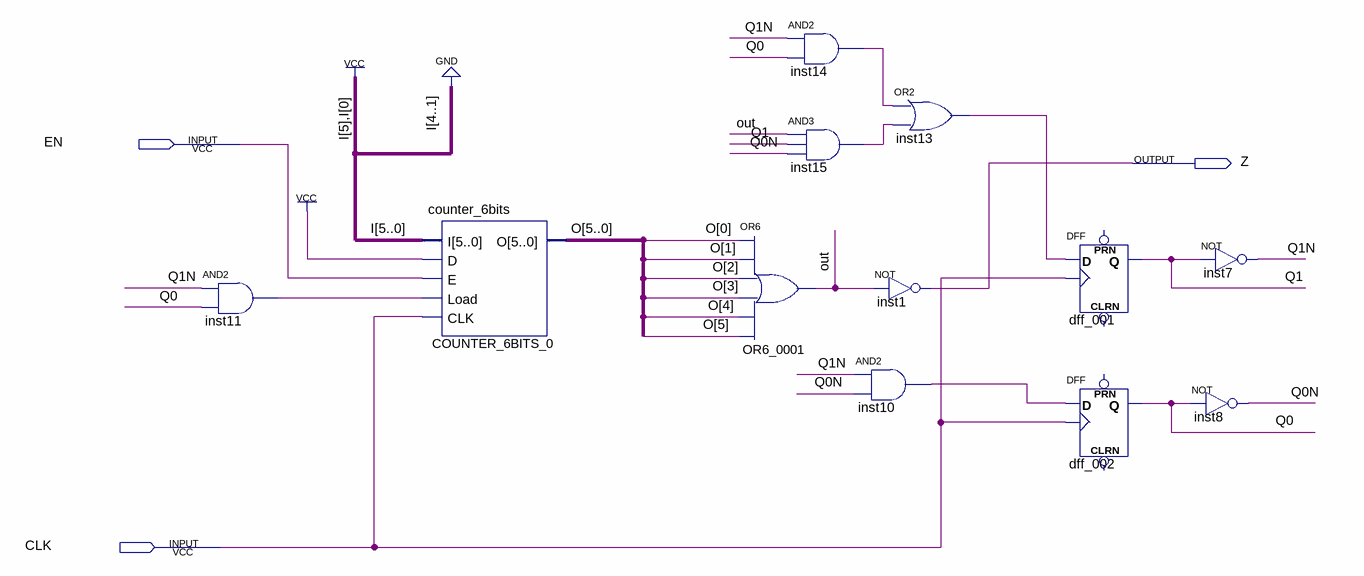
[diagram p0: schematic sheet]
// Quartus schematic counteDown_33.bdf as structural Verilog: 12 symbols, 3 pins
module counteDown_33 (
  input  EN,
  input  CLK,
  output Z
);

  wire inst10_out, inst11_out, inst13_out, inst14_out, inst15_out, Q0, Q0N, Q1, Q1N;
  wire [5:0] O;

  and inst11 (inst11_out, Q1N, Q0);
  counter_6bits COUNTER_6BITS_0 (.I(6'b100001), .D(1'b1), .E(EN), .Load(inst11_out), .CLK(CLK), .O(O));
  or OR6_0001 (Z, O[0], O[1], O[2], O[3], O[4], O[5]);
  and inst14 (inst14_out, Q1N, Q0);
  and inst15 (inst15_out, Z, Q1, Q0N);
  and inst10 (inst10_out, Q1N, Q0N);
  or inst13 (inst13_out, inst14_out, inst15_out);
  not inst1 (Z, Z);
  DFF dff_001 (.CLK(CLK), .D(inst13_out), .Q(Q1));  // open: CLRN, PRN
  DFF dff_002 (.CLK(CLK), .D(inst10_out), .Q(Q0));  // open: CLRN, PRN
  not inst7 (Q1N, Q1);
  not inst8 (Q0N, Q0);

  // Other names for the same wires on the sheet: out = Z
endmodule
